# Altium schematic sheet F280041.SchDoc
size 594 x 420 mm; SheetNumber: 1; SheetTotal: 1
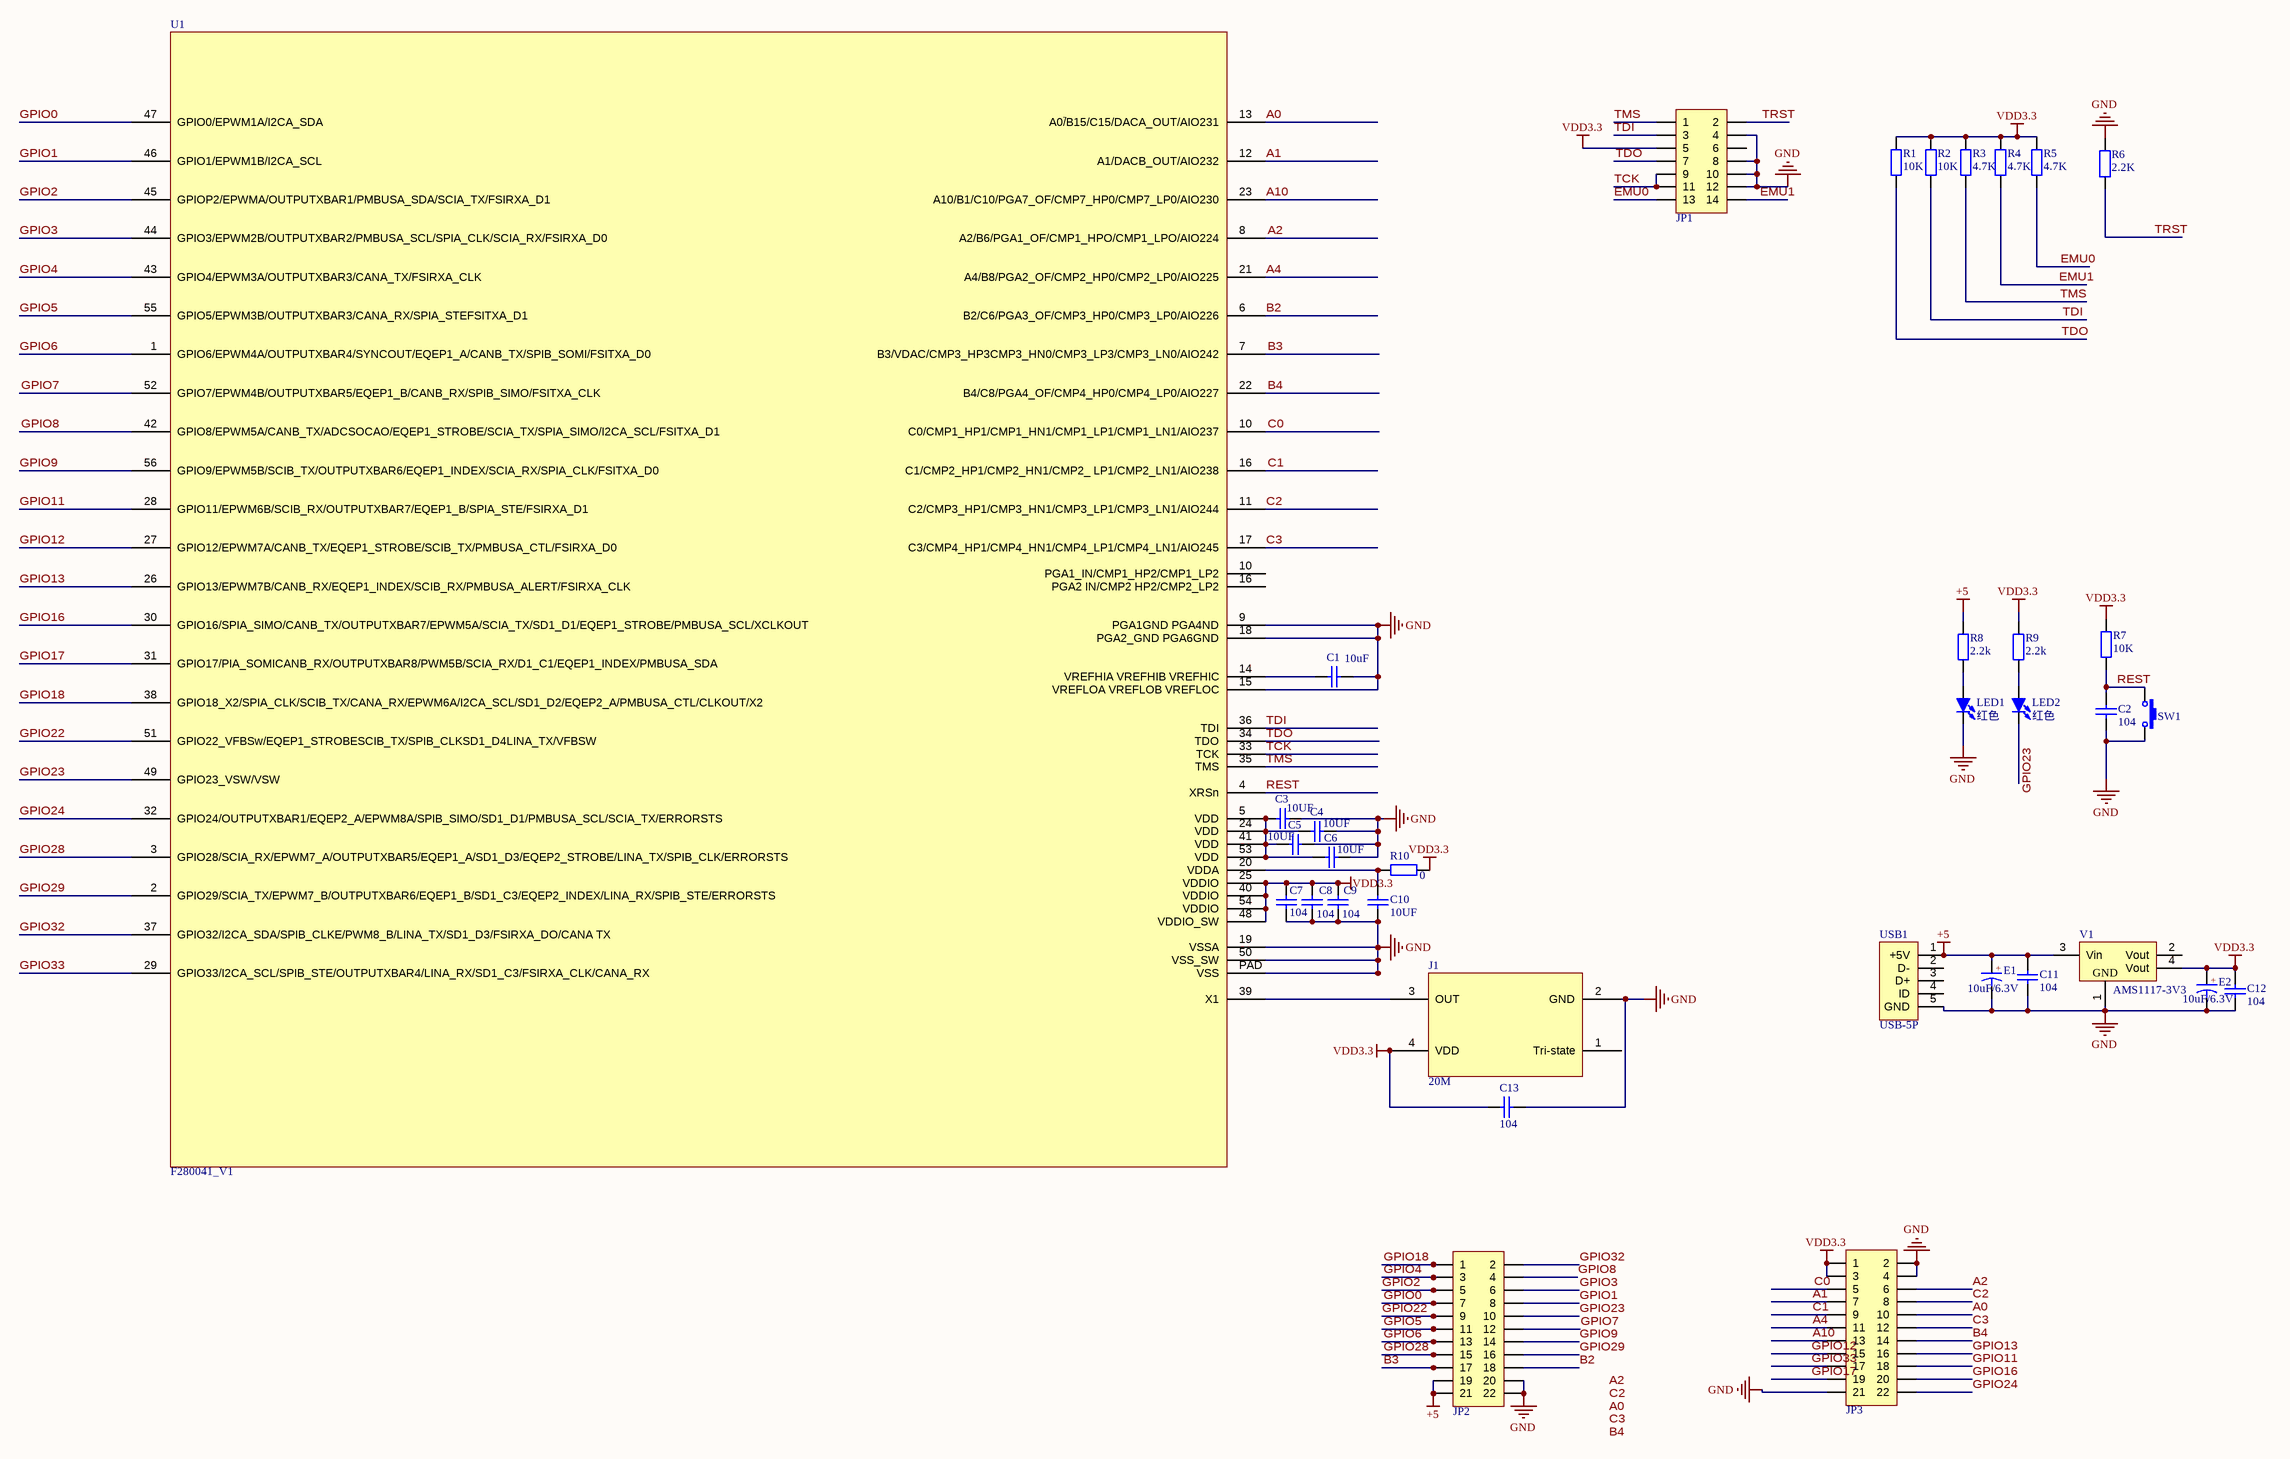
[diagram p0: F280041.SchDoc]

## Parts
C1  10uF  [C0603_M]
C2  104  [C0603_M]
C3  10UF  [C0603_M]
C4  10UF  [C0603_M]
C5  10UF  [C0603_M]
C6  10UF  [C0603_M]
C7  104  [C0603_M]
C8  104  [C0603_M]
C9  104  [C0603_M]
C10  10UF  [C0603_M]
C11  104  [C0603_M]
C12  104  [C0603_M]
C13  104  [C0603_M]
E1  10uF/6.3V  [C_3216]
E2  10uF/6.3V  [C_3216]
J1  20M  [PCBComponent_1]
JP1  JTAG  [HDR2.54-LI-2x7P]  (value not drawn)
JP2  Header 2X11  [HDR2.54-LI-2x11P]  (value not drawn)
JP3  Header 2X11  [HDR2.54-LI-2x11P]  (value not drawn)
LED1  红色  [LED0603_R]
LED2  红色  [LED0603_R]
R1  10K  [R0603_M]
R2  10K  [R0603_M]
R3  4.7K  [R0603_M]
R4  4.7K  [R0603_M]
R5  4.7K  [R0603_M]
R6  2.2K  [R0603_M]
R7  10K  [R0603_M]
R8  2.2k  [R0603_M]
R9  2.2k  [R0603_M]
R10  0  [R0603_M]
SW1  3x6x5  [SW SMD-3*6*2.5]  (value not drawn)
U1  F280041_V1  [QFN40P700X700X100_HS-57N]
USB1  USB-5P  [USB-MICRO_A]
V1  AMS1117-3V3  [SOT223_M]

## Nets
+5: C11.2 E1.1(A) JP2.19 JP2.21 R8.2 USB1.1(+5V) V1.3(Vin)
GND: C1.2 C2.1 C3.2 C4.2 C5.2 C6.2 C7.1 C8.1 C9.1 C10.1 C11.1 C12.1 C13.2 E1.2(K) E2.2(K) J1.2(GND) JP1.4 JP1.8 JP1.10 JP1.12 JP2.20 JP2.22 JP3.2 JP3.4 JP3.21 LED1.2(K) R6.1 SW1.2 U1.9(PGA1GND_PGA4ND) U1.15(VREFLOA_VREFLOB_VREFLOC) U1.18(PGA2_GND_PGA6GND) U1.19(VSSA) U1.50(VSS_SW) U1.PAD(VSS) USB1.5(GND) V1.1(GND)
VDD3.3: C7.2 C8.2 C9.2 C12.2 C13.1 E2.1(A) J1.4(VDD) JP1.5 JP3.1 JP3.3 R1.1 R2.1 R3.1 R4.1 R5.1 R7.2 R9.2 R10.1 U1.25(VDDIO) U1.40(VDDIO) U1.48(VDDIO_SW) U1.54(VDDIO) V1.4(Vout)
A0: JP3.10 U1.13(A0~{/}B15/C15/DACA_OUT/AIO231)
A1: JP3.7 U1.12(A1/DACB_OUT/AIO232)
A2: JP3.6 U1.8(A2/B6/PGA1_OF/CMP1_HPO/CMP1_LPO/AIO224)
A4: JP3.11 U1.21(A4/B8/PGA2_OF/CMP2_HP0/CMP2_LP0/AIO225)
A10: JP3.13 U1.23(A10/B1/C10/PGA7_OF/CMP7_HP0/CMP7_LP0/AIO230)
B2: JP2.18 U1.6(B2/C6/PGA3_OF/CMP3_HP0/CMP3_LP0/AIO226)
B3: JP2.17 U1.7(B3/VDAC/CMP3_HP3CMP3_HN0/CMP3_LP3/CMP3_LN0/AIO242)
B4: JP3.14 U1.22(B4/C8/PGA4_OF/CMP4_HP0/CMP4_LP0/AIO227)
C0: JP3.5 U1.10(C0/CMP1_HP1/CMP1_HN1/CMP1_LP1/CMP1_LN1/AIO237)
C1: JP3.9 U1.16(C1/CMP2_HP1/CMP2_HN1/CMP2__LP1/CMP2_LN1/AIO238)
C2: JP3.8 U1.11(C2/CMP3_HP1/CMP3_HN1/CMP3_LP1/CMP3_LN1/AIO244)
C3: JP3.12 U1.17(C3/CMP4_HP1/CMP4_HN1/CMP4_LP1/CMP4_LN1/AIO245)
EMU0: JP1.13 R5.2
EMU1: JP1.14 R4.2
GPIO0: JP2.7 U1.47(GPIO0/EPWM1A/I2CA_SDA)
GPIO1: JP2.8 U1.46(GPIO1/EPWM1B/I2CA_SCL)
GPIO2: JP2.5 U1.45(GPIOP2/EPWMA/OUTPUTXBAR1/PMBUSA_SDA/SCIA_TX/FSIRXA_D1)
GPIO3: JP2.6 U1.44(GPIO3/EPWM2B/OUTPUTXBAR2/PMBUSA_SCL/SPIA_CLK/SCIA_RX/FSIRXA_D0)
GPIO4: JP2.3 U1.43(GPIO4/EPWM3A/OUTPUTXBAR3/CANA_TX/FSIRXA_CLK)
GPIO5: JP2.11 U1.55(GPIO5/EPWM3B/OUTPUTXBAR3/CANA_RX/SPIA_STEFSITXA_D1)
GPIO6: JP2.13 U1.1(GPIO6/EPWM4A/OUTPUTXBAR4/SYNCOUT/EQEP1_A/CANB_TX/SPIB_SOMI/FSITXA_D0)
GPIO7: JP2.12 U1.52(GPIO7/EPWM4B/OUTPUTXBAR5/EQEP1_B/CANB_RX/SPIB_SIMO/FSITXA_CLK)
GPIO8: JP2.4 U1.42(GPIO8/EPWM5A/CANB_TX/ADCSOCAO/EQEP1_STROBE/SCIA_TX/SPIA_SIMO/I2CA_SCL/FSITXA_D1)
GPIO9: JP2.14 U1.56(GPIO9/EPWM5B/SCIB_TX/OUTPUTXBAR6/EQEP1_INDEX/SCIA_RX/SPIA_CLK/FSITXA_D0)
GPIO11: JP3.18 U1.28(GPIO11/EPWM6B/SCIB_RX/OUTPUTXBAR7/EQEP1_B/SPIA_STE/FSIRXA_D1)
GPIO12: JP3.15 U1.27(GPIO12/EPWM7A/CANB_TX/EQEP1_STROBE/SCIB_TX/PMBUSA_CTL/FSIRXA_D0)
GPIO13: JP3.16 U1.26(GPIO13/EPWM7B/CANB_RX/EQEP1_INDEX/SCIB_RX/PMBUSA_ALERT/FSIRXA_CLK)
GPIO16: JP3.20 U1.30(GPIO16/SPIA_SIMO/CANB_TX/OUTPUTXBAR7/EPWM5A/SCIA_TX/SD1_D1/EQEP1_STROBE/PMBUSA_SCL/XCLKOUT)
GPIO17: JP3.19 U1.31(GPIO17/PIA_SOMICANB_RX/OUTPUTXBAR8/PWM5B/SCIA_RX/D1_C1/EQEP1_INDEX/PMBUSA_SDA)
GPIO18: JP2.1 U1.38(GPIO18_X2/SPIA_CLK/SCIB_TX/CANA_RX/EPWM6A/I2CA_SCL/SD1_D2/EQEP2_A/PMBUSA_CTL/CLKOUT/X2)
GPIO22: JP2.9 U1.51(GPIO22_VFBSw/EQEP1_STROBESCIB_TX/SPIB_CLKSD1_D4LINA_TX/VFBSW)
GPIO23: JP2.10 LED2.2(K) U1.49(GPIO23_VSW/VSW)
GPIO24: JP3.22 U1.32(GPIO24/OUTPUTXBAR1/EQEP2_A/EPWM8A/SPIB_SIMO/SD1_D1/PMBUSA_SCL/SCIA_TX/ERRORSTS)
GPIO28: JP2.15 U1.3(GPIO28/SCIA_RX/EPWM7_A/OUTPUTXBAR5/EQEP1_A/SD1_D3/EQEP2_STROBE/LINA_TX/SPIB_CLK/ERRORSTS)
GPIO29: JP2.16 U1.2(GPIO29/SCIA_TX/EPWM7_B/OUTPUTXBAR6/EQEP1_B/SD1_C3/EQEP2_INDEX/LINA_RX/SPIB_STE/ERRORSTS)
GPIO32: JP2.2 U1.37(GPIO32/I2CA_SDA/SPIB_CLKE/PWM8_B/LINA_TX/SD1_D3/FSIRXA_DO/CANA_TX)
GPIO33: JP3.17 U1.29(GPIO33/I2CA_SCL/SPIB_STE/OUTPUTXBAR4/LINA_RX/SD1_C3/FSIRXA_CLK/CANA_RX)
REST: C2.2 R7.1 SW1.1 U1.4(XRSn)
TCK: JP1.9 JP1.11 U1.33(TCK)
TDI: JP1.3 R2.2 U1.36(TDI)
TDO: JP1.7 R1.2 U1.34(TDO)
TMS: JP1.1 R3.2 U1.35(TMS)
TRST: JP1.2 R6.2
NetC1_1: C1.1 U1.14(VREFHIA_VREFHIB_VREFHIC)
NetC3_1: C3.1 C4.1 C5.1 C6.1 U1.5(VDD) U1.24(VDD) U1.41(VDD) U1.53(VDD)
NetC10_2: C10.2 R10.2 U1.20(VDDA)
NetJ1_3: J1.3(OUT) U1.39(X1)
NetLED1_1: LED1.1(A) R8.1
NetLED2_1: LED2.1(A) R9.1

Not connected (* = marked no-connect by the designer): J1 1(Tri-state); JP1 6; USB1 2(D-) 3(D+) 4(ID); V1 2(Vout)

## Notes on the sheet
- Labels drawn without touching a wire or pin: A0, A2, B4, C2, C3
- DWG NO:
- REV:
- THIS DOCUMENT AND THE DATA DISCLOSED HEREIN OR
- HEREWITH IS THE PROPERTY OF ALTIUM LIMITED AND MAY
- BE FREELY DISTRIBUTED IN WHOLE. NO RIGHTS ARE
- RESERVED OR EXPRESS OR IMPLIED WARANTEE GIVEN.
- REVISION
- DESCRIPTION
- DATE
- APPROVED
- ENG:
- APPROVALS
- PROJECT
- DSN:
- CHK:
- REFERENCE DOCUMENTS
- PROJECT REVISION:
- TITLE
- DOCUMENT REVISION:
- DESIGN ITEM:
- BOM:
- FAB DWG:
- PCB DWG:
- ASSY DWG:
- SCALE:
- A2
- SIZE
- CAGE CODE
- FILE NAME
- DWG NO.
- SHEET
- OF
- REV
- (in symbol CT) +

## Library data of the parts
C1-C13 = C: 贴片电容; BOM名称: 无极性贴片电容; 联系卖家，免费查找封装: 唯一出售店铺网址https://shop463601444.taobao.com
E1 E2 = CT: 贴片钽电容; 联系卖家，免费查找封装: 唯一出售店铺网址https://shop463601444.taobao.com; 封装库来自淘宝卖家ID：黄晶宝石: 其他店铺购入均为盗版假冒封装库，请立即申请退款; BOM名称: 贴片钽电容
JP1 = Header 7X2: 7*2P接插件; 封装库来自淘宝卖家 ID：黄晶宝石: 其他店铺购入均为盗版假冒封装库; 联系卖家，免费查找封装: 唯一出售店铺网址https://shop463601444.taobao.com; BOM名称: 7*2P接插件
JP2 JP3 = Header 11X2: 11*2P接插件; 封装库来自淘宝卖家 ID：黄晶宝石: 其他店铺购入均为盗版假冒封装库; 联系卖家，免费查找封装: 唯一出售店铺网址https://shop463601444.taobao.com; BOM名称: 11*2P接插件
LED1 LED2 = LED-SMD: 贴片LED; 封装库来自淘宝卖家 ID：黄晶宝石: 其他店铺购入均为假冒，请立即申请退款，本店奖励现金5~20元; BOM名称: 贴片LED
R1-R10 = R: 贴片电阻; 联系卖家，免费查找封装: 唯一出售店铺网址https://shop463601444.taobao.com; 封装库来自淘宝卖家ID：黄晶宝石: 其他店铺购入均为盗版假冒封装库，请立即申请退款; BOM名称: 贴片电阻
SW1 = SW-PB: 微动开关; BOM名称: 3x6轻触开关; 联系卖家，免费查找封装: 唯一出售店铺网址https://shop463601444.taobao.com
USB1 = USB-5P: 微型USB母座; 联系卖家，免费技术支持: 唯一出售店铺网址https://shop463601444.taobao.com; BOM名称: 微型USB母座
V1 = AMS1117: 三端稳压芯片; BOM名称: 稳压芯片; 封装库来自淘宝卖家 ID：黄晶宝石: 其他店铺购入均为盗版，请立即申请退款，本店现金奖励5~20元; 联系卖家 免费查找封装: 唯一出售店铺网址https://shop463601444.taobao.com